# EAGLE schematic nibbler (EAGLE 7.5.0)
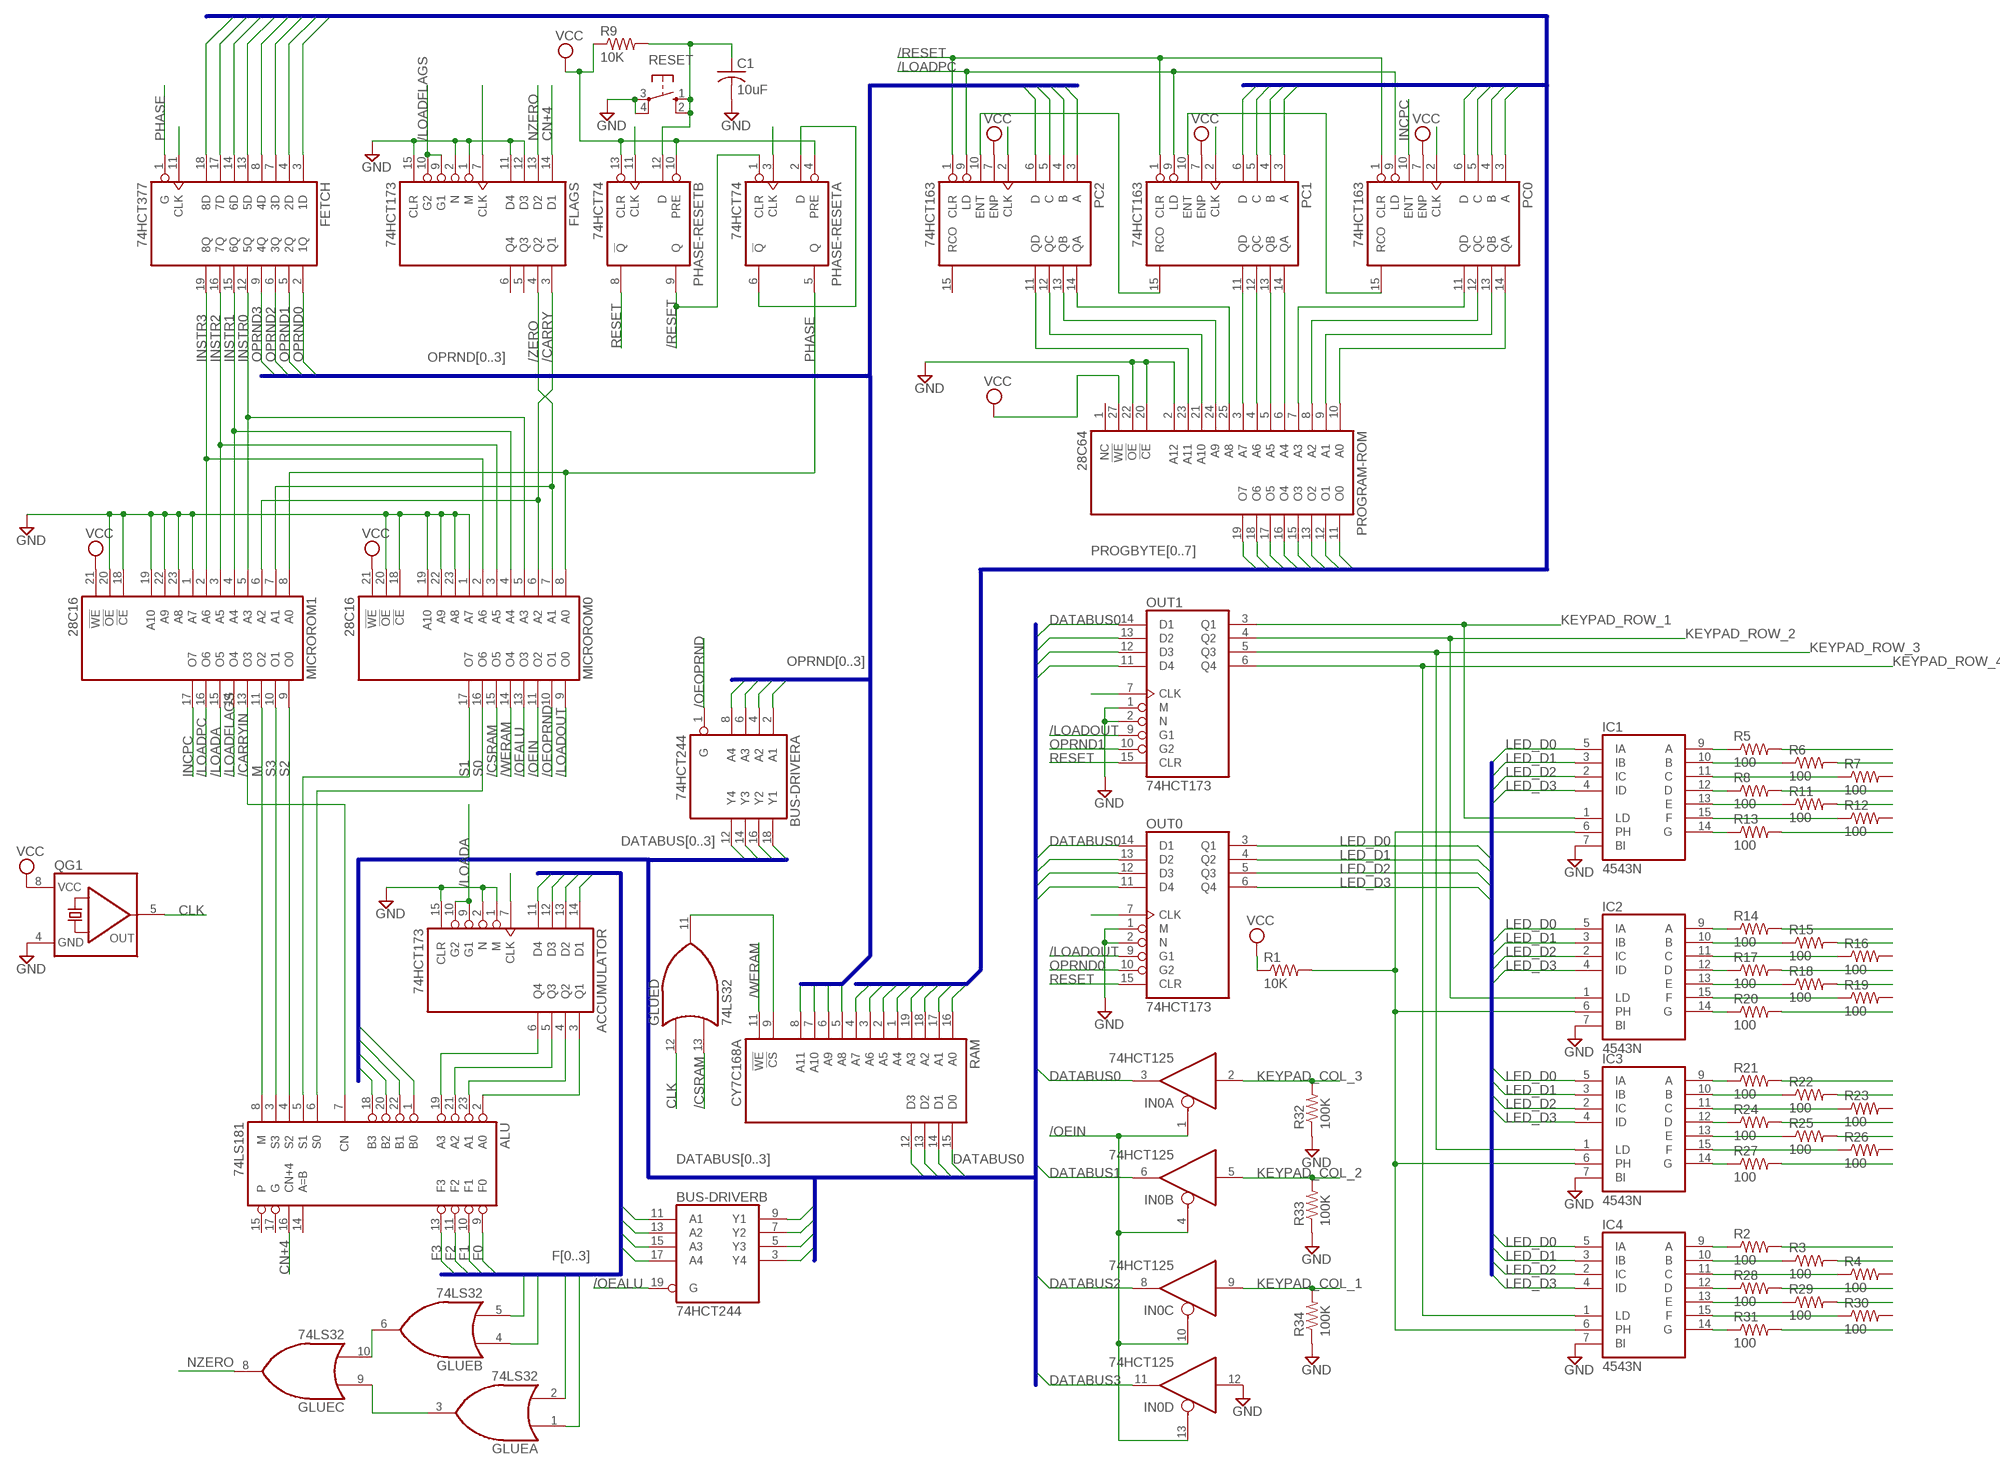
[diagram p0: schematic, sheet 1]

## Parts
ACCUMULATOR  74HCT173  74LS173N  [DIL16]
ALU  74LS181  74LS181N  [DIL24-6]
BUS-DRIVER  74HCT244  74LS244N  [DIL20]
C1  10uF  C-US025-024X044  [C025-024X044]
FETCH  74HCT377  74LS377N  [DIL20]
FLAGS  74HCT173  74LS173N  [DIL16]
GLUE  74LS32  74*32N  [DIL14]
IC1  4543N  [DIL16]
IC2  4543N  [DIL16]
IC3  4543N  [DIL16]
IC4  4543N  [DIL16]
IN0  74HCT125  74125N  [DIL14]
MICROROM0  28C16  [DIL24]
MICROROM1  28C16  [DIL24]
OUT0  74HCT173  74LS173N  [DIL16]
OUT1  74HCT173  74LS173N  [DIL16]
PC0  74HCT163  74163N  [DIL16]
PC1  74HCT163  74163N  [DIL16]
PC2  74HCT163  74163N  [DIL16]
PHASE-RESET  74HCT74  74LS74N  [DIL14]
PROGRAM-ROM  28C64  [DIL28]
QG1  QG5460  [DIL08S]
R1  10K  R-US_0204/5  [0204/5]
R2  100  R-US_0204/5  [0204/5]
R3  100  R-US_0204/5  [0204/5]
R4  100  R-US_0204/5  [0204/5]
R5  100  R-US_0204/5  [0204/5]
R6  100  R-US_0204/5  [0204/5]
R7  100  R-US_0204/5  [0204/5]
R8  100  R-US_0204/5  [0204/5]
R9  10K  R-US_0204/5  [0204/5]
R11  100  R-US_0204/5  [0204/5]
R12  100  R-US_0204/5  [0204/5]
R13  100  R-US_0204/5  [0204/5]
R14  100  R-US_0204/5  [0204/5]
R15  100  R-US_0204/5  [0204/5]
R16  100  R-US_0204/5  [0204/5]
R17  100  R-US_0204/5  [0204/5]
R18  100  R-US_0204/5  [0204/5]
R19  100  R-US_0204/5  [0204/5]
R20  100  R-US_0204/5  [0204/5]
R21  100  R-US_0204/5  [0204/5]
R22  100  R-US_0204/5  [0204/5]
R23  100  R-US_0204/5  [0204/5]
R24  100  R-US_0204/5  [0204/5]
R25  100  R-US_0204/5  [0204/5]
R26  100  R-US_0204/5  [0204/5]
R27  100  R-US_0204/5  [0204/5]
R28  100  R-US_0204/5  [0204/5]
R29  100  R-US_0204/5  [0204/5]
R30  100  R-US_0204/5  [0204/5]
R31  100  R-US_0204/5  [0204/5]
R32  100K  R-US_0204/5  [0204/5]
R33  100K  R-US_0204/5  [0204/5]
R34  100K  R-US_0204/5  [0204/5]
RAM  CY7C168A  51C68  [DIL20]
RESET  10-XX  [B3F-10XX]

## Nets
/CARRY: FLAGS.3(Q1) MICROROM0.6(A2) MICROROM1.6(A2)
/CARRYIN: ALU.7(CN) MICROROM1.13(O3)
/CSRAM: GLUE.13(D:I1) MICROROM0.15(O5)
/LOADA: ACCUMULATOR.9(G1) ACCUMULATOR.10(G2) MICROROM1.15(O5)
/LOADFLAGS: FLAGS.9(G1) FLAGS.10(G2) MICROROM1.14(O4)
/LOADOUT: MICROROM0.9(O0) OUT0.9(G1) OUT1.9(G1)
/LOADPC: MICROROM1.16(O6) PC0.9(LD) PC1.9(LD) PC2.9(LD)
/OEALU: BUS-DRIVER.19(B:G) MICROROM0.13(O3)
/OEIN: IN0.1(A:OE) IN0.4(B:OE) IN0.10(C:OE) IN0.13(D:OE) MICROROM0.11(O2)
/OEOPRND: BUS-DRIVER.1(A:G) MICROROM0.10(O1)
/RESET: PC0.1(CLR) PC1.1(CLR) PC2.1(CLR) PHASE-RESET.1(A:CLR) PHASE-RESET.9(B:Q)
/WERAM: MICROROM0.14(O4) RAM.11(!WE)
/ZERO: FLAGS.4(Q2) MICROROM0.7(A1) MICROROM1.7(A1)
CLK: ACCUMULATOR.7(CLK) FETCH.11(CLK) FLAGS.7(CLK) GLUE.12(D:I0) OUT0.7(CLK) OUT1.7(CLK) PC0.2(CLK) PC1.2(CLK) PC2.2(CLK) PHASE-RESET.3(A:CLK) PHASE-RESET.11(B:CLK) QG1.5(OUT)
CN+4: ALU.16(CN+4) FLAGS.14(D1)
DATABUS0: ALU.1(B0) BUS-DRIVER.9(B:Y1) BUS-DRIVER.18(A:Y1) IN0.3(A:O) OUT0.14(D1) OUT1.14(D1) RAM.15(D0)
DATABUS1: ALU.22(B1) BUS-DRIVER.7(B:Y2) BUS-DRIVER.16(A:Y2) IN0.6(B:O) OUT0.13(D2) OUT1.13(D2) RAM.14(D1)
DATABUS2: ALU.20(B2) BUS-DRIVER.5(B:Y3) BUS-DRIVER.14(A:Y3) IN0.8(C:O) OUT0.12(D3) OUT1.12(D3) RAM.13(D2)
DATABUS3: ALU.18(B3) BUS-DRIVER.3(B:Y4) BUS-DRIVER.12(A:Y4) IN0.11(D:O) OUT0.11(D4) OUT1.11(D4) RAM.12(D3)
F0: ACCUMULATOR.14(D1) ALU.9(F0) BUS-DRIVER.11(B:A1) GLUE.1(A:I0)
F1: ACCUMULATOR.13(D2) ALU.10(F1) BUS-DRIVER.13(B:A2) GLUE.2(A:I1)
F2: ACCUMULATOR.12(D3) ALU.11(F2) BUS-DRIVER.15(B:A3) GLUE.4(B:I0)
F3: ACCUMULATOR.11(D4) ALU.13(F3) BUS-DRIVER.17(B:A4) GLUE.5(B:I1)
GND: ACCUMULATOR.1(M) ACCUMULATOR.2(N) ACCUMULATOR.15(CLR) C1.2 FLAGS.1(M) FLAGS.2(N) FLAGS.11(D4) FLAGS.12(D3) FLAGS.15(CLR) IC1.7(BI) IC2.7(BI) IC3.7(BI) IC4.7(BI) IN0.12(D:I) MICROROM0.1(A7) MICROROM0.18(!CE) MICROROM0.19(A10) MICROROM0.20(!OE) MICROROM0.22(A9) MICROROM0.23(A8) MICROROM1.1(A7) MICROROM1.18(!CE) MICROROM1.19(A10) MICROROM1.20(!OE) MICROROM1.22(A9) MICROROM1.23(A8) OUT0.1(M) OUT0.2(N) OUT1.1(M) OUT1.2(N) PROGRAM-ROM.2(A12) PROGRAM-ROM.20(!CE) PROGRAM-ROM.22(!OE) QG1.4(GND) R32.1 R33.1 R34.1 RESET.3(P) RESET.4(P1)
INCPC: MICROROM1.17(O7) PC0.10(ENT)
INSTR0: FETCH.12(5Q) MICROROM0.5(A3) MICROROM1.5(A3)
INSTR1: FETCH.15(6Q) MICROROM0.4(A4) MICROROM1.4(A4)
INSTR2: FETCH.16(7Q) MICROROM0.3(A5) MICROROM1.3(A5)
INSTR3: FETCH.19(8Q) MICROROM0.2(A6) MICROROM1.2(A6)
KEYPAD_COL_1: IN0.9(C:I) R34.2
KEYPAD_COL_2: IN0.5(B:I) R33.2
KEYPAD_COL_3: IN0.2(A:I) R32.2
KEYPAD_ROW_1: IC1.1(LD) OUT1.3(Q1)
KEYPAD_ROW_2: IC2.1(LD) OUT1.4(Q2)
KEYPAD_ROW_3: IC3.1(LD) OUT1.5(Q3)
KEYPAD_ROW_4: IC4.1(LD) OUT1.6(Q4)
LED_D0: IC1.5(IA) IC2.5(IA) IC3.5(IA) IC4.5(IA) OUT0.3(Q1)
LED_D1: IC1.3(IB) IC2.3(IB) IC3.3(IB) IC4.3(IB) OUT0.4(Q2)
LED_D2: IC1.2(IC) IC2.2(IC) IC3.2(IC) IC4.2(IC) OUT0.5(Q3)
LED_D3: IC1.4(ID) IC2.4(ID) IC3.4(ID) IC4.4(ID) OUT0.6(Q4)
M: ALU.8(M) MICROROM1.11(O2)
N$1: PHASE-RESET.2(A:D) PHASE-RESET.6(A:!Q)
N$2: ACCUMULATOR.3(Q1) ALU.2(A0)
N$3: PC0.15(RCO) PC1.10(ENT)
N$4: ACCUMULATOR.4(Q2) ALU.23(A1)
N$5: ACCUMULATOR.5(Q3) ALU.21(A2)
N$6: ACCUMULATOR.6(Q4) ALU.19(A3)
N$7: PC1.15(RCO) PC2.10(ENT)
N$8: PC1.13(QB) PROGRAM-ROM.5(A5)
N$9: PC1.14(QA) PROGRAM-ROM.6(A4)
N$10: PC0.11(QD) PROGRAM-ROM.7(A3)
N$11: PC0.12(QC) PROGRAM-ROM.8(A2)
N$12: PC0.13(QB) PROGRAM-ROM.9(A1)
N$13: PC0.14(QA) PROGRAM-ROM.10(A0)
N$14: PC1.12(QC) PROGRAM-ROM.4(A6)
N$15: PC1.11(QD) PROGRAM-ROM.3(A7)
N$16: PC2.14(QA) PROGRAM-ROM.25(A8)
N$17: PC2.13(QB) PROGRAM-ROM.24(A9)
N$18: PC2.12(QC) PROGRAM-ROM.21(A10)
N$19: PC2.11(QD) PROGRAM-ROM.23(A11)
N$24: C1.1 PHASE-RESET.12(B:D) R9.2 RESET.1(S) RESET.2(S1)
N$27: GLUE.6(B:O) GLUE.10(C:I1)
N$29: GLUE.3(A:O) GLUE.9(C:I0)
N$30: GLUE.11(D:O) RAM.9(!CS)
N$46: IC1.6(PH) IC2.6(PH) IC3.6(PH) IC4.6(PH) R1.2
N$47: IC1.9(A) R5.1
N$48: IC1.10(B) R6.1
N$49: IC1.11(C) R7.1
N$50: IC1.12(D) R8.1
N$51: IC1.13(E) R11.1
N$52: IC1.15(F) R12.1
N$53: IC1.14(G) R13.1
N$54: IC2.9(A) R14.1
N$55: IC2.10(B) R15.1
N$56: IC2.11(C) R16.1
N$57: IC2.12(D) R17.1
N$58: IC2.13(E) R18.1
N$59: IC2.15(F) R19.1
N$60: IC2.14(G) R20.1
N$61: IC3.9(A) R21.1
N$62: IC3.10(B) R22.1
N$63: IC3.11(C) R23.1
N$64: IC3.12(D) R24.1
N$65: IC3.13(E) R25.1
N$66: IC3.15(F) R26.1
N$67: IC3.14(G) R27.1
N$68: R5.2
N$69: R6.2
N$70: R8.2
N$71: R11.2
N$72: R13.2
N$73: R14.2
N$74: R15.2
N$75: R17.2
N$76: R18.2
N$77: R20.2
N$78: R21.2
N$79: R22.2
N$80: R24.2
N$81: R25.2
N$82: R27.2
N$83: R2.1
N$84: R3.1
N$85: R4.1
N$86: R28.1
N$87: R29.1
N$88: R30.1
N$89: R31.1
N$90: R2.2
N$91: R3.2
N$92: R28.2
N$93: R29.2
N$94: R31.2
NZERO: FLAGS.13(D2) GLUE.8(C:O)
OPRND0: BUS-DRIVER.2(A:A1) FETCH.2(1Q) OUT0.10(G2) PC2.3(A) RAM.5(A8)
OPRND1: BUS-DRIVER.4(A:A2) FETCH.5(2Q) OUT1.10(G2) PC2.4(B) RAM.6(A9)
OPRND2: BUS-DRIVER.6(A:A3) FETCH.6(3Q) PC2.5(C) RAM.7(A10)
OPRND3: BUS-DRIVER.8(A:A4) FETCH.9(4Q) PC2.6(D) RAM.8(A11)
PHASE: FETCH.1(G) MICROROM0.8(A0) MICROROM1.8(A0) PHASE-RESET.5(A:Q)
PROGBYTE0: FETCH.3(1D) PC0.3(A) PROGRAM-ROM.11(O0) RAM.16(A0)
PROGBYTE1: FETCH.4(2D) PC0.4(B) PROGRAM-ROM.12(O1) RAM.17(A1)
PROGBYTE2: FETCH.7(3D) PC0.5(C) PROGRAM-ROM.13(O2) RAM.18(A2)
PROGBYTE3: FETCH.8(4D) PC0.6(D) PROGRAM-ROM.15(O3) RAM.19(A3)
PROGBYTE4: FETCH.13(5D) PC1.3(A) PROGRAM-ROM.16(O4) RAM.1(A4)
PROGBYTE5: FETCH.14(6D) PC1.4(B) PROGRAM-ROM.17(O5) RAM.2(A5)
PROGBYTE6: FETCH.17(7D) PC1.5(C) PROGRAM-ROM.18(O6) RAM.3(A6)
PROGBYTE7: FETCH.18(8D) PC1.6(D) PROGRAM-ROM.19(O7) RAM.4(A7)
RESET: OUT0.15(CLR) OUT1.15(CLR) PHASE-RESET.8(B:!Q)
S0: ALU.6(S0) MICROROM0.16(O6)
S1: ALU.5(S1) MICROROM0.17(O7)
S2: ALU.4(S2) MICROROM1.9(O0)
S3: ALU.3(S3) MICROROM1.10(O1)
VCC: MICROROM0.21(!WE) MICROROM1.21(!WE) PC0.7(ENP) PC1.7(ENP) PC2.7(ENP) PHASE-RESET.4(A:PRE) PHASE-RESET.10(B:PRE) PHASE-RESET.13(B:CLR) PROGRAM-ROM.27(!WE) QG1.8(VCC) R1.1 R9.1
Unconnected: ALU.14(A=B) ALU.15(P) ALU.17(G) FLAGS.5(Q3) FLAGS.6(Q4) IC4.9(A) IC4.10(B) IC4.11(C) IC4.12(D) IC4.13(E) IC4.14(G) IC4.15(F) PC2.15(RCO) PROGRAM-ROM.1(NC) R4.2 R7.2 R12.2 R16.2 R19.2 R23.2 R26.2 R30.2

## Buses
OPRND[0..3]
DATABUS[0..3]
F[0..3]
PROGBYTE[0..7]
LCD

## Power pins joined to a net without a drawn wire
GND: ACCUMULATOR.8(GND) ALU.12(GND) BUS-DRIVER.10(P:GND) FETCH.10(GND) FLAGS.8(GND) GLUE.7(P:GND) IN0.7(P:GND) MICROROM0.12(GND) MICROROM1.12(GND) OUT0.8(GND) OUT1.8(GND) PC0.8(GND) PC1.8(GND) PC2.8(GND) PHASE-RESET.7(P:GND) PROGRAM-ROM.14(GND) RAM.10(GND)
VCC: ACCUMULATOR.16(VCC) ALU.24(VCC) BUS-DRIVER.20(P:VCC) FETCH.20(VCC) FLAGS.16(VCC) GLUE.14(P:VCC) IN0.14(P:VCC) MICROROM0.24(VCC) MICROROM1.24(VCC) OUT0.16(VCC) OUT1.16(VCC) PC0.16(VCC) PC1.16(VCC) PC2.16(VCC) PHASE-RESET.14(P:VCC) PROGRAM-ROM.28(VCC) RAM.20(VCC)
VDD: IC1.16(VDD) IC2.16(VDD) IC3.16(VDD) IC4.16(VDD)
VSS: IC1.8(VSS) IC2.8(VSS) IC3.8(VSS) IC4.8(VSS)

## Library data of the parts
ACCUMULATOR FLAGS OUT0 OUT1 = big-mess-o-wires:74*173: 4-bit D type REGISTER, 3-state
ALU = big-mess-o-wires:74*181: ARITHMETIC LOGIC UNIT function generator
BUS-DRIVER = big-mess-o-wires:74*244: Octal BUFFER and LINE DRIVER, 3-state
C1 = resistor:C-US: CAPACITOR, American symbol
FETCH = big-mess-o-wires:74*377: Octal D type FLIP FLOP, enable
GLUE = big-mess-o-wires:74*32: Quad 2-input OR gate
IC1-IC4 = 45xx:4543: BCD to 7-segment LCD DECODER
IN0 = big-mess-o-wires:74*125: Quad bus BUFFER, 3-state
MICROROM0 MICROROM1 = big-mess-o-wires:28C16: MEMORY
PC0 PC1 PC2 = big-mess-o-wires:74*163: Synchronous 4-bit COUNTER
PHASE-RESET = big-mess-o-wires:74*74: Dual D type positive edge triggered FLIP FLOP, preset and clear
PROGRAM-ROM = big-mess-o-wires:28C64: MEMORY
QG1 = crystal:QG5460: CRYSTAL RESONATOR; OC_FARNELL: unknown; OC_NEWARK: unknown
R1-R9 R11-R34 = rcl:R-US_: RESISTOR, American symbol
RAM = memory:51C68: MEMORY
RESET = switch-omron:10-XX: OMRON SWITCH; MPN: B3F-1000; OC_FARNELL: 176432; OC_NEWARK: 36M3542

## Module LDS-AA12RI
Ports: 

### Library data of the parts